# EAGLE design sr_lights (EAGLE 7.6.0)
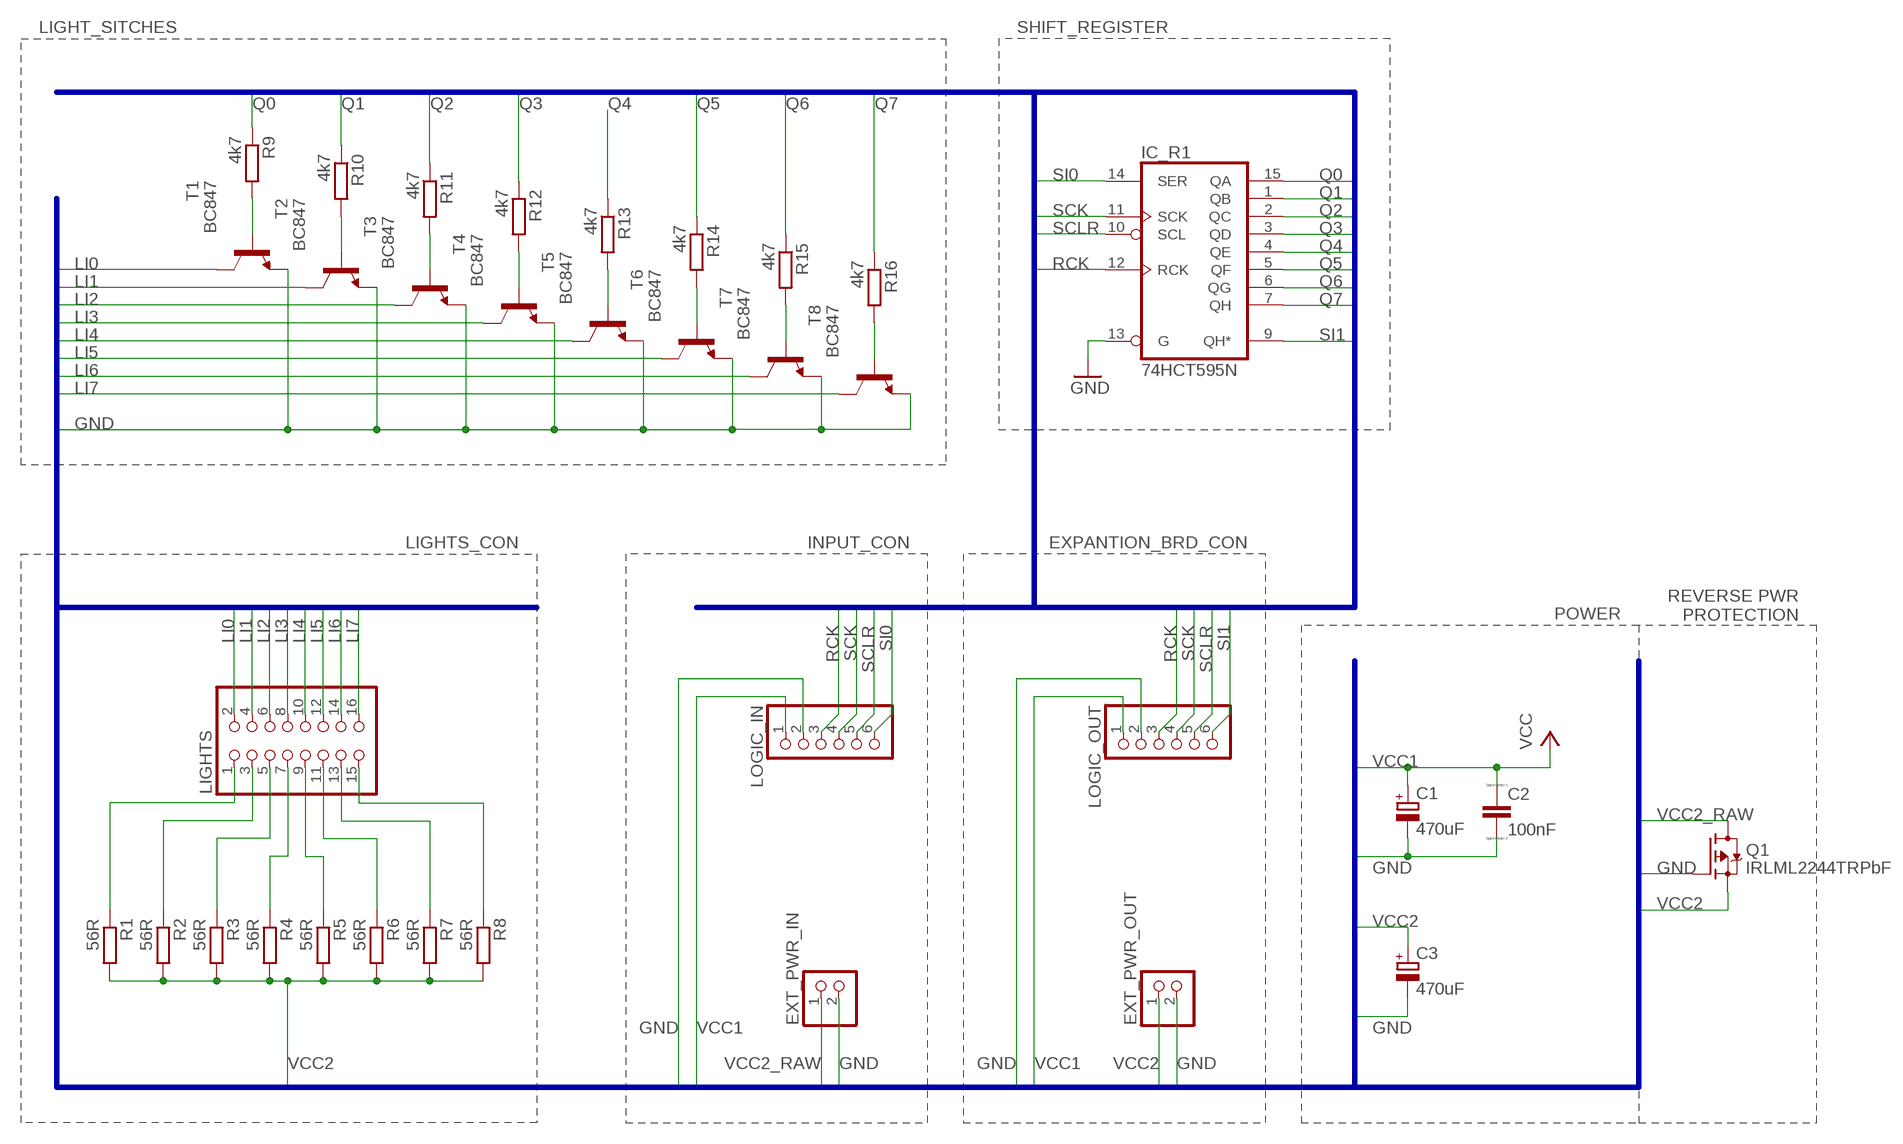
[diagram p0: schematic, sheet 1]

## Parts
C1  470uF  CPOL-EUTT2D6  [TT2D6]
C2  100nF  C  [C0805]
C3  470uF  CPOL-EUTT2D6  [TT2D6]
EXT_PWR_IN  PINHD-1X2  [1X02]
EXT_PWR_OUT  PINHD-1X2  [1X02]
IC_R1  74HCT595N  [DIL16]
LIGHTS  PINHD-2X8  [2X08]
LOGIC_IN  PINHD-1X6  [1X06]
LOGIC_OUT  PINHD-1X6  [1X06]
Q1  IRLML2244TRPbF  MOSFET-P-SOT23  [SOT23]
R1  56R  R-EU_M0805  [M0805]
R2  56R  R-EU_M0805  [M0805]
R3  56R  R-EU_M0805  [M0805]
R4  56R  R-EU_M0805  [M0805]
R5  56R  R-EU_M0805  [M0805]
R6  56R  R-EU_M0805  [M0805]
R7  56R  R-EU_M0805  [M0805]
R8  56R  R-EU_M0805  [M0805]
R9  4k7  R-EU_M0805  [M0805]
R10  4k7  R-EU_M0805  [M0805]
R11  4k7  R-EU_M0805  [M0805]
R12  4k7  R-EU_M0805  [M0805]
R13  4k7  R-EU_M0805  [M0805]
R14  4k7  R-EU_M0805  [M0805]
R15  4k7  R-EU_M0805  [M0805]
R16  4k7  R-EU_M0805  [M0805]
T1  BC847  [SOT23]
T2  BC847  [SOT23]
T3  BC847  [SOT23]
T4  BC847  [SOT23]
T5  BC847  [SOT23]
T6  BC847  [SOT23]
T7  BC847  [SOT23]
T8  BC847  [SOT23]

## Nets
GND [power]: C1.- C2.2 C3.- EXT_PWR_IN.2 EXT_PWR_OUT.2 IC_R1.13(G) LOGIC_IN.2 LOGIC_OUT.2 Q1.1(G) T1.2(E) T2.2(E) T3.2(E) T4.2(E) T5.2(E) T6.2(E) T7.2(E) T8.2(E)
LI0: LIGHTS.2 T1.3(C)
LI1: LIGHTS.4 T2.3(C)
LI2: LIGHTS.6 T3.3(C)
LI3: LIGHTS.8 T4.3(C)
LI4: LIGHTS.10 T5.3(C)
LI5: LIGHTS.12 T6.3(C)
LI6: LIGHTS.14 T7.3(C)
LI7: LIGHTS.16 T8.3(C)
N$19: LIGHTS.1 R1.1
N$20: LIGHTS.3 R2.1
N$21: LIGHTS.5 R3.1
N$22: LIGHTS.15 R8.1
N$23: LIGHTS.13 R7.1
N$24: R9.2 T1.1(B)
N$25: R10.2 T2.1(B)
N$26: R11.2 T3.1(B)
N$27: R12.2 T4.1(B)
N$28: R13.2 T5.1(B)
N$29: R14.2 T6.1(B)
N$30: LIGHTS.11 R6.1
N$31: LIGHTS.7 R4.1
N$32: LIGHTS.9 R5.1
N$37: R15.2 T7.1(B)
N$38: R16.2 T8.1(B)
Q0: IC_R1.15(QA) R9.1
Q1: IC_R1.1(QB) R10.1
Q2: IC_R1.2(QC) R11.1
Q3: IC_R1.3(QD) R12.1
Q4: IC_R1.4(QE) R13.1
Q5: IC_R1.5(QF) R14.1
Q6: IC_R1.6(QG) R15.1
Q7: IC_R1.7(QH) R16.1
RCK: IC_R1.12(RCK) LOGIC_IN.3 LOGIC_OUT.3
SCK: IC_R1.11(SCK) LOGIC_IN.4 LOGIC_OUT.4
SCLR: IC_R1.10(SCL) LOGIC_IN.5 LOGIC_OUT.5
SI0: IC_R1.14(SER) LOGIC_IN.6
SI1: IC_R1.9(QH*) LOGIC_OUT.6
VCC1 [low_power]: C1.+ C2.1 LOGIC_IN.1 LOGIC_OUT.1 ; supply symbol labelled VCC
VCC2 [power]: C3.+ EXT_PWR_OUT.1 Q1.2(S) R1.2 R2.2 R3.2 R4.2 R5.2 R6.2 R7.2 R8.2
VCC2_RAW: EXT_PWR_IN.1 Q1.3(D)

## Buses
SR_SIGNAL:RCK,SCLR,SCK,SI[0..1],Q[0..7]
OUTS:LI[0..7],VCC1,VCC2,GND,VCC2_RAW

## Notes on the sheet
- LIGHT_SITCHES | SHIFT_REGISTER
- LIGHTS_CON | INPUT_CON | EXPANTION_BRD_CON
- REVERSE PWR
  PROTECTION
- POWER

## Power pins joined to a net without a drawn wire
GND: IC_R1.8(GND)
VCC1: IC_R1.16(VCC)

## Library data of the parts
C1 C3 = rcl:CPOL-EU: POLARIZED CAPACITOR, European symbol; KOSMODROM: ECAP-RD-470mkf - 10v
C2 = eagle-ltspice:C: CAPACITOR, European symbol; SPICEMODEL: NONE; SPICEPREFIX: C
EXT_PWR_IN EXT_PWR_OUT = pinhead:PINHD-1X2: PIN HEADER
IC_R1 = 74xx-eu:74*595: 8-bit SHIFT REGISTER, output latch
LIGHTS = pinhead:PINHD-2X8: PIN HEADER
LOGIC_IN LOGIC_OUT = pinhead:PINHD-1X6: PIN HEADER
Q1 = we-transistor:MOSFET-P: P-Channel MOSFET (e.g. IRLML6402)
R1 = rcl:R-EU_: RESISTOR, European symbol; KOSMODROM: SMD-резистор (1206) 56 om ±5% SMD-резистор 1206
R2-R16 = rcl:R-EU_: RESISTOR, European symbol
T1-T8 = transistor:BC847: NPN TRANSISTOR

## Net classes
1 power: width 1.27 mm
2 low_power: width 1.27 mm

## Board
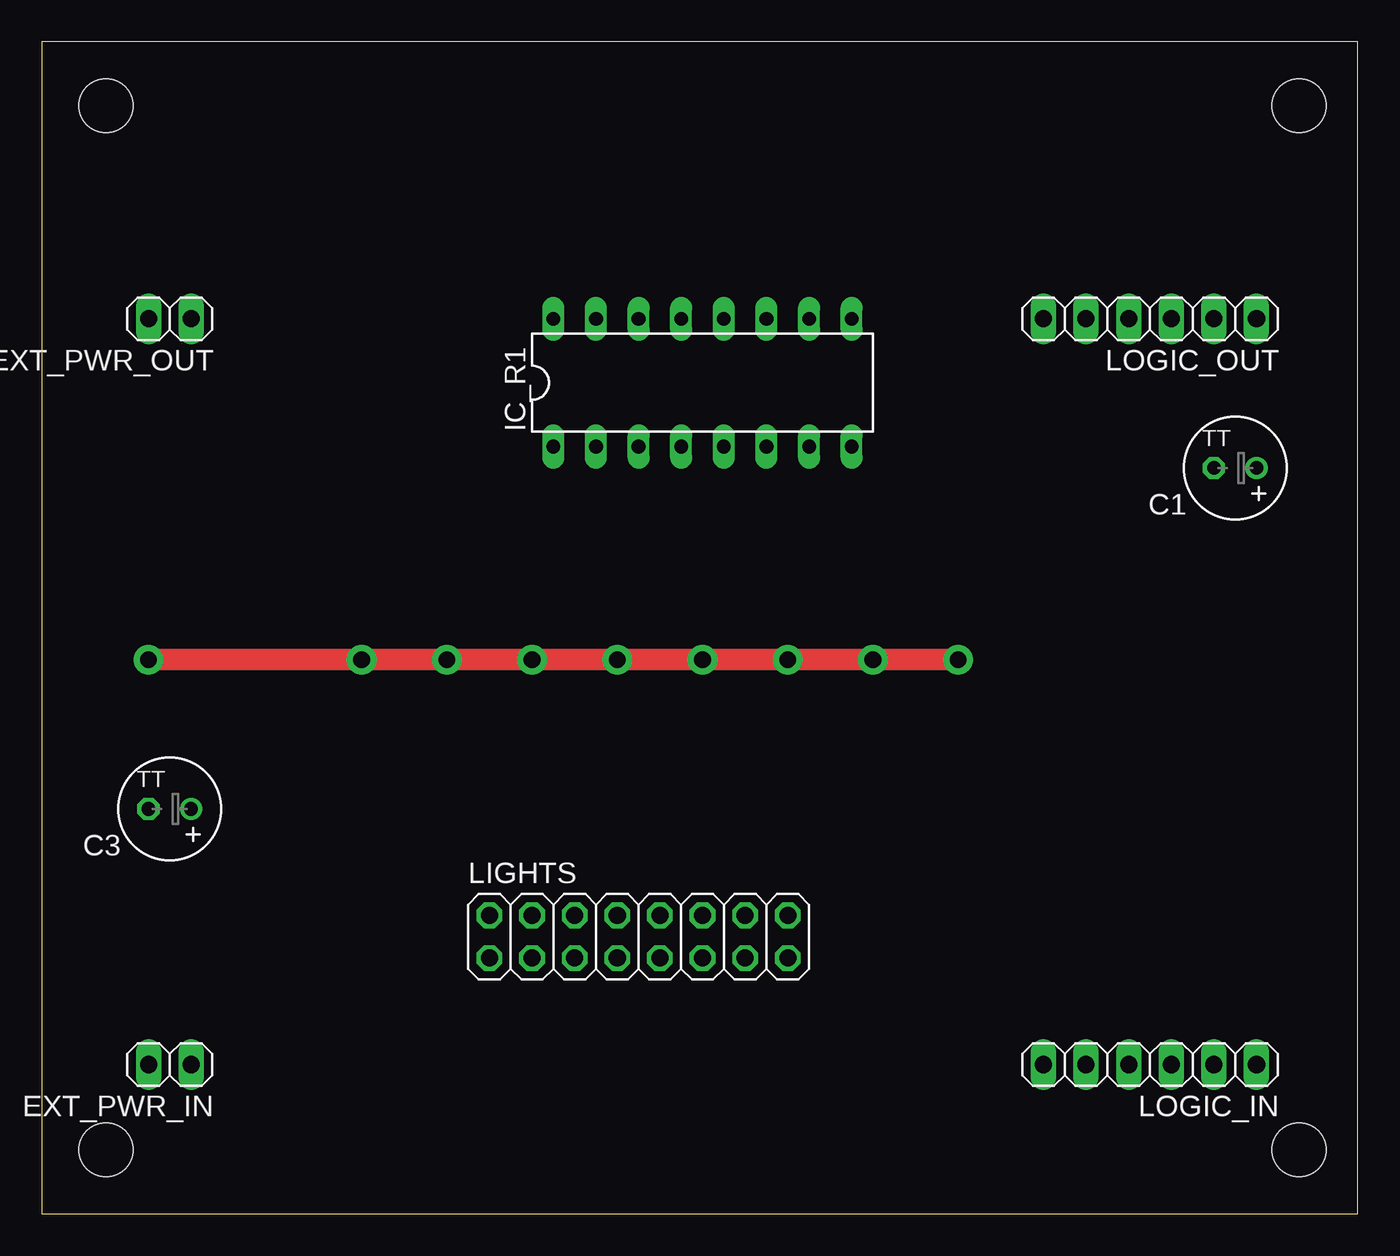
[diagram p1: board, top side]
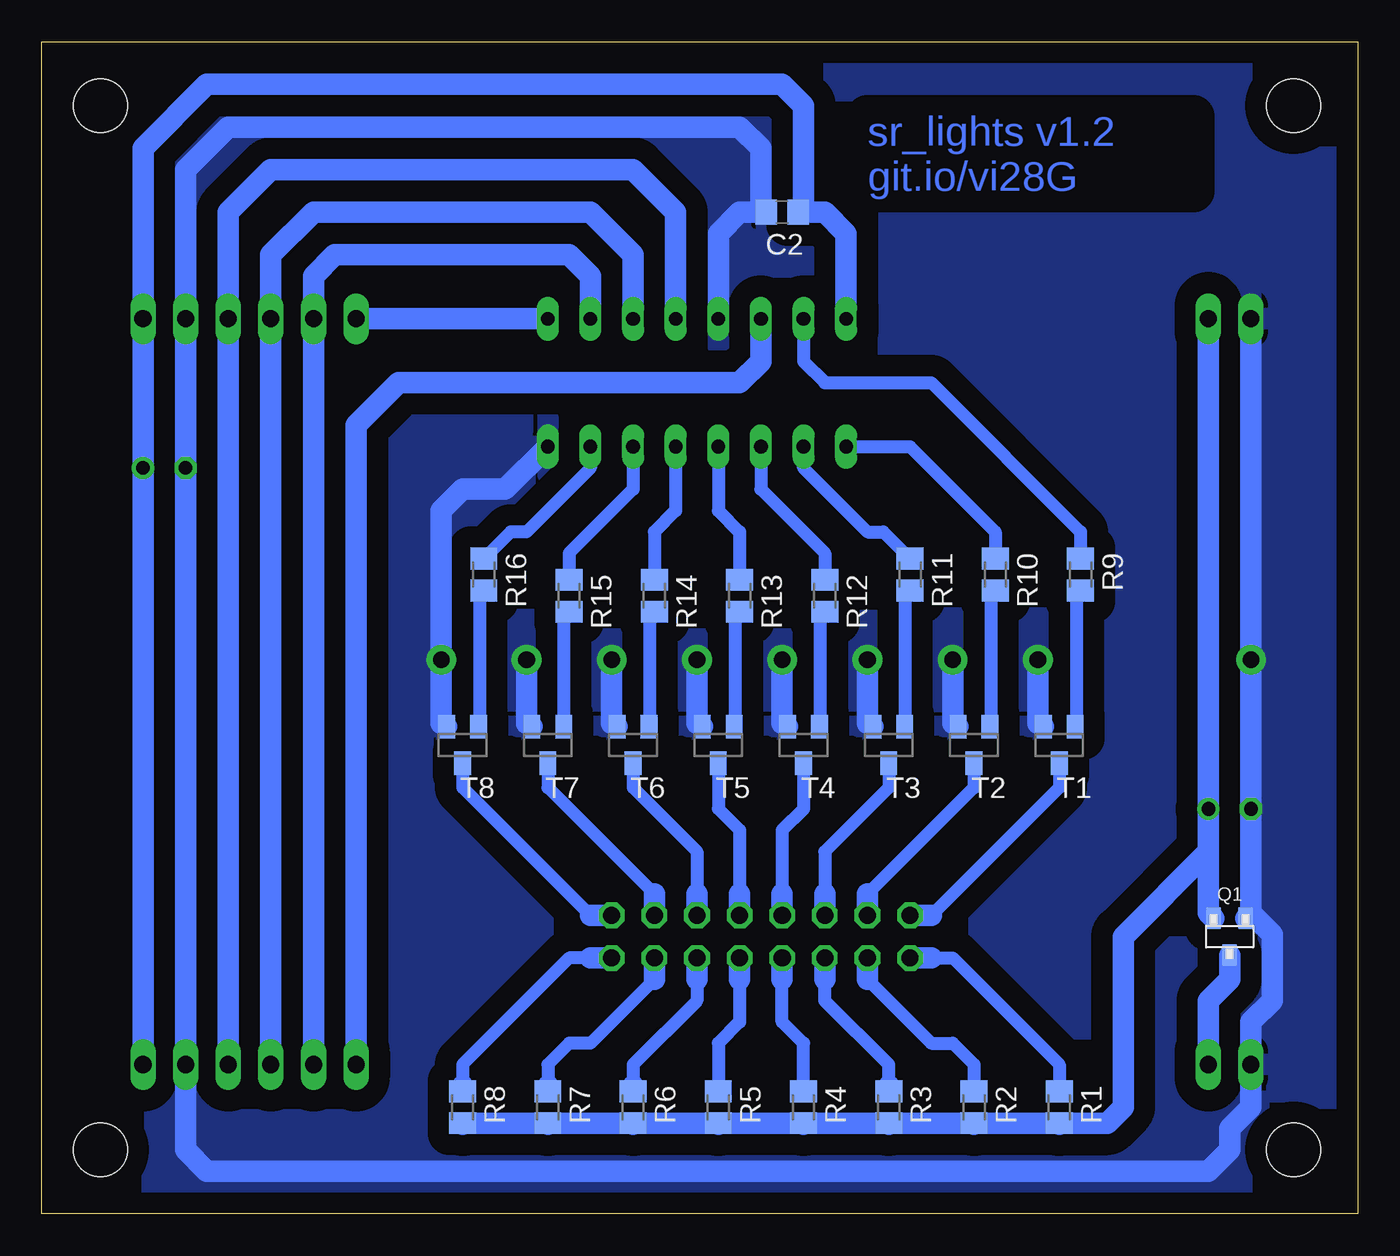
[diagram p2: board, bottom side, seen from below]

Size 78.41 x 69.84 mm. Coordinates in mm from the lower left corner, seen from the top.
Outline: 0,0 78.41,0 78.41,69.84 0,69.84 0,0
Copper layers (1*16): Top 0.035mm / dielectric 1.5mm / Bottom 0.035mm
Design rules "current": minimum track width 20mil, minimum drill 24mil, track to track 24mil, track to pad 24mil, pad to pad 20mil, via to via 20mil, smd to smd 8mil, copper to edge 40mil, drill to drill 13mil, minimum pad ring 10mil, minimum via ring 8mil, stop-mask expansion 4mil, vias tented up to drill 0mil, thermal gap 10mil
Holes 3.2 mm at 74.93,3.81 3.81,66.04 3.81,3.81 74.93,66.04

### Footprints (pad centres in the part's own frame; a part is rotated, then mirrored left to right if it is on the bottom)
TT2D6 = drill 0.813: + -1.27,0 | drill 0.813 octagon: - 1.27,0
C0805 = smd 1.3 x 1.5: 1 -0.95,0; 2 0.95,0
1X02 = drill 1.016 long: 1 -1.27,0; 2 1.27,0
DIL16 = drill 0.813 long: 1 -8.89,-3.81; 2 -6.35,-3.81; 3 -3.81,-3.81; 4 -1.27,-3.81; 5 1.27,-3.81; 6 3.81,-3.81; 7 6.35,-3.81; 8 8.89,-3.81; 9 8.89,3.81; 10 6.35,3.81; 11 3.81,3.81; 12 1.27,3.81; 13 -1.27,3.81; 14 -3.81,3.81; 15 -6.35,3.81; 16 -8.89,3.81
2X08 = drill 1.016 octagon: 1 -8.89,-1.27; 2 -8.89,1.27; 3 -6.35,-1.27; 4 -6.35,1.27; 5 -3.81,-1.27; 6 -3.81,1.27; 7 -1.27,-1.27; 8 -1.27,1.27; 9 1.27,-1.27; 10 1.27,1.27; 11 3.81,-1.27; 12 3.81,1.27; 13 6.35,-1.27; 14 6.35,1.27; 15 8.89,-1.27; 16 8.89,1.27
1X06 = drill 1.016 long: 1 -6.35,0; 2 -3.81,0; 3 -1.27,0; 4 1.27,0; 5 3.81,0; 6 6.35,0
SOT23 = smd 1.3 x 0.9: 1 -1.1,0.95; 2 -1.1,-0.95; 3 1.1,0
M0805 = smd 1.3 x 1.6: 1 -0.95,0; 2 0.95,0
SOT23' = smd 1 x 1.4: 1 -0.95,-1.1; 2 0.95,-1.1; 3 0,1.1

### Placement (x,y rotation side)
C1  71.12,44.45 180 top
C2  34.29,59.69 180 bottom
C3  7.62,24.13 180 top
EXT_PWR_IN  7.62,8.89 180 top
EXT_PWR_OUT  7.62,53.34 180 top
IC_R1  39.37,49.53 0 top
LIGHTS  35.56,16.51 0 top
LOGIC_IN  66.04,8.89 180 top
LOGIC_OUT  66.04,53.34 180 top
Q1  7.62,16.51 270 bottom
R1  17.78,6.35 270 bottom
R2  22.86,6.35 270 bottom
R3  27.94,6.35 270 bottom
R4  33.02,6.35 270 bottom
R5  38.1,6.35 270 bottom
R6  43.18,6.35 270 bottom
R7  48.26,6.35 270 bottom
R8  53.34,6.35 270 bottom
R9  16.51,38.1 270 bottom
R10  21.59,38.1 270 bottom
R11  26.67,38.1 270 bottom
R12  31.75,36.83 270 bottom
R13  36.83,36.83 270 bottom
R14  41.91,36.83 270 bottom
R15  46.99,36.83 270 bottom
R16  52.07,38.1 270 bottom
T1  BC847  [SOT23']  17.78,27.94 180 bottom
T2  BC847  [SOT23']  22.86,27.94 180 bottom
T3  BC847  [SOT23']  27.94,27.94 180 bottom
T4  BC847  [SOT23']  33.02,27.94 180 bottom
T5  BC847  [SOT23']  38.1,27.94 180 bottom
T6  BC847  [SOT23']  43.18,27.94 180 bottom
T7  BC847  [SOT23']  48.26,27.94 180 bottom
T8  BC847  [SOT23']  53.34,27.94 180 bottom

### Tracks (layer width: path | path; a pad name or v marks a point on that pad's centre or on a via)
GND  (via drill 1 pad 1.78)
  Top 1.27: v6.35,33.02 v19.05,33.02 v24.13,33.02 v29.21,33.02 v34.29,33.02 v39.37,33.02 v44.45,33.02 v49.53,33.02 v54.61,33.02
  Bottom 1.27: EXT_PWR_OUT.2 v6.35,33.02 C3.- 6.35,17.93 | IC_R1.8 50.8,43.18 53.34,43.18 54.61,41.91 v54.61,33.02 54.61,29.21 T8.2 | IC_R1.13 38.1,58.42 36.83,59.69 C2.2 35.56,60.01 35.56,63.5 36.83,64.77 67.31,64.77 69.85,62.23 LOGIC_OUT.2 C1.- LOGIC_IN.2 69.85,3.81 68.58,2.54 8.89,2.54 7.62,3.81 7.62,5.08 6.35,6.35 EXT_PWR_IN.2 6.35,11.43 5.08,12.7 5.08,16.66 6.35,17.93 | Q1.1 6.35,17.93 | v19.05,33.02 19.05,29.21 T1.2 | v24.13,33.02 24.13,29.21 T2.2 | v29.21,33.02 29.21,29.21 T3.2 | v34.29,33.02 34.29,29.21 T4.2 | v39.37,33.02 39.37,29.21 T5.2 | v44.45,33.02 44.45,29.21 T6.2 | v49.53,33.02 49.53,29.21 T7.2
  pour Bottom (isolate 1.27): 0,69.85 78.74,69.85 78.74,0 0,0
LI0
  Bottom 0.508: 17.78,26.67 T1.3
  Bottom 0.762: T1.3 17.78,25.4 25.4,17.78
  Bottom 1.27: LIGHTS.2 25.4,17.78
LI1
  Bottom 0.508: 22.86,26.67 T2.3
  Bottom 0.762: T2.3 22.86,25.4 29.21,19.05
  Bottom 1.27: LIGHTS.4 29.21,19.05
LI2
  Bottom 0.508: 27.94,26.67 T3.3
  Bottom 0.762: T3.3 27.94,25.4 31.75,21.59 31.75,19.05
  Bottom 1.27: LIGHTS.6 31.75,19.05
LI3
  Bottom 0.762: T4.3 33.02,24.13 34.29,22.86 34.29,19.05
  Bottom 1.27: LIGHTS.8 34.29,19.05
LI4
  Bottom 0.762: T5.3 38.1,24.13 36.83,22.86 36.83,19.05
  Bottom 1.27: LIGHTS.10 36.83,19.05
LI5
  Bottom 0.508: 43.18,26.67 T6.3
  Bottom 0.762: T6.3 43.18,25.4 39.37,21.59 39.37,19.05
  Bottom 1.27: LIGHTS.12 39.37,19.05
LI6
  Bottom 0.762: T7.3 48.26,25.4 41.91,19.05
  Bottom 1.27: LIGHTS.14 41.91,19.05
LI7
  Bottom 0.508: 53.34,26.67 T8.3
  Bottom 0.762: T8.3 53.34,25.4 45.72,17.78
  Bottom 1.27: LIGHTS.16 45.72,17.78
N$19
  Bottom 0.762: 25.4,15.24 24.13,15.24 17.78,8.89 R1.1
  Bottom 1.27: LIGHTS.1 25.4,15.24
N$20
  Bottom 0.762: 29.21,13.97 25.4,10.16 24.13,10.16 22.86,8.89 R2.1
  Bottom 1.27: LIGHTS.3 29.21,13.97
N$21
  Bottom 0.762: 27.94,7.62 27.94,8.89 31.75,12.7 31.75,13.97
  Bottom 1.27: 27.94,7.62 R3.1 | LIGHTS.5 31.75,13.97
N$22
  Bottom 0.762: 45.72,15.24 46.99,15.24 53.34,8.89 R8.1
  Bottom 1.27: 53.34,7.62 R8.1 | LIGHTS.15 45.72,15.24
N$23
  Bottom 0.762: 41.91,13.97 45.72,10.16 46.99,10.16 48.26,8.89 R7.1
  Bottom 1.27: 48.26,7.62 R7.1 | LIGHTS.13 41.91,13.97
N$24
  Bottom 0.508: 16.76,36.83 16.51,37.08 R9.2 | 16.76,29.21 T1.1
  Bottom 0.762: 16.76,36.83 16.76,29.11 T1.1
N$25
  Bottom 0.508: 21.84,36.83 21.59,37.08 R10.2 | 21.84,29.21 T2.1
  Bottom 0.762: 21.84,36.83 21.84,29.11 T2.1
N$26
  Bottom 0.508: 26.67,37.08 26.92,36.83 | 26.92,29.21 T3.1 | R11.2 26.67,36.83 26.99,36.76
  Bottom 0.762: 26.92,29.11 T3.1 26.99,36.76 26.92,36.83
N$27
  Bottom 0.508: 32,29.21 T4.1
  Bottom 0.762: 32,29.21 32,35.63 R12.2
N$28
  Bottom 0.508: 37.08,29.21 T5.1
  Bottom 0.762: 37.08,29.21 37.08,35.63 R13.2
N$29
  Bottom 0.508: 42.16,29.21 T6.1
  Bottom 0.762: 42.16,29.21 42.16,35.63 R14.2
N$30
  Bottom 0.762: 39.37,13.97 39.37,12.7 43.18,8.89 R6.1
  Bottom 1.27: 43.18,7.62 R6.1 | LIGHTS.11 39.37,13.97
N$31
  Bottom 0.762: R4.1 33.02,10.16 34.29,11.43 34.29,13.97
  Bottom 1.27: LIGHTS.7 34.29,13.97
N$32
  Bottom 0.762: 36.83,13.97 36.83,11.43 38.1,10.16 R5.1
  Bottom 1.27: LIGHTS.9 36.83,13.97
N$37
  Bottom 0.508: 47.24,29.21 T7.1
  Bottom 0.762: R15.2 47.31,35.56 T7.1
N$38
  Bottom 0.508: 52.32,36.83 52.07,37.08 R16.2 | 52.32,29.21 T8.1
  Bottom 0.762: 52.32,36.83 52.32,29.11 T8.1
Q0
  Bottom 0.508: 16.51,39.37 R9.1
  Bottom 0.762: IC_R1.15 33.02,50.8 31.75,49.53 25.4,49.53 16.51,40.64 R9.1
Q1
  Bottom 0.508: 21.69,39.12 R10.1
  Bottom 0.762: IC_R1.1 26.67,45.72 21.59,40.64 R10.1
Q2
  Bottom 0.762: R11.1 28.26,40.64 29.21,40.64 33.02,44.45 IC_R1.2
Q3
  Bottom 0.762: IC_R1.3 35.56,43.18 31.75,39.37 R12.1
Q4
  Bottom 0.508: 36.78,37.85 R13.1
  Bottom 0.762: IC_R1.4 38.1,41.91 36.83,40.64 R13.1
Q5
  Bottom 0.762: IC_R1.5 40.64,41.91 41.91,40.64 R14.1
Q6
  Bottom 0.762: IC_R1.6 43.18,43.18 46.99,39.37 R15.1
Q7
  Bottom 0.508: 51.87,39.12 R16.1
  Bottom 0.762: IC_R1.7 45.72,44.45 49.53,40.64 50.48,40.64 R16.1
RCK
  Bottom 1.27: LOGIC_IN.3 LOGIC_OUT.3 67.31,59.69 64.77,62.23 43.18,62.23 40.64,59.69 IC_R1.12
SCK
  Bottom 1.27: LOGIC_IN.4 LOGIC_OUT.4 64.77,57.15 62.23,59.69 45.72,59.69 43.18,57.15 IC_R1.11
SCLR
  Bottom 1.27: LOGIC_IN.5 LOGIC_OUT.5 62.23,55.88 60.96,57.15 46.99,57.15 45.72,55.88 IC_R1.10
SI0
  Bottom 1.27: IC_R1.14 35.56,50.8 36.83,49.53 57.15,49.53 59.69,46.99 LOGIC_IN.6
SI1
  Bottom 1.27: IC_R1.9 LOGIC_OUT.6
VCC1
  Bottom 1.27: IC_R1.16 30.48,58.42 31.75,59.69 C2.1 33.02,60.01 33.02,66.04 34.29,67.31 68.58,67.31 72.39,63.5 LOGIC_OUT.1 C1.+ LOGIC_IN.1
VCC2
  Bottom 1.27: 27.94,5.33 R3.2 | 33.02,5.33 R4.2 | 38.1,5.33 R5.2 | 43.18,5.33 R6.2 | 53.34,5.33 R8.2 R7.2 | 48.26,5.33 R7.2 | 22.86,5.33 R2.2 | EXT_PWR_OUT.1 C3.+ 8.89,21.59 | R2.2 17.85,5.4 17.78,5.33 R1.2 14.92,5.4 13.97,6.35 13.97,16.51 8.89,21.59 | R2.2 R3.2 | R3.2 R4.2 | R4.2 R5.2 | R5.2 R6.2 | R6.2 R7.2 | Q1.2 8.89,17.93 8.89,21.59
VCC2_RAW
  Bottom 1.27: Q1.3 7.62,13.97 8.89,12.7 EXT_PWR_IN.1

### Text on the board
Bottom: sr_lights v1.2 / git.io/vi28G